# EAGLE design BioHackBoardPolulu (EAGLE 7.1.0)
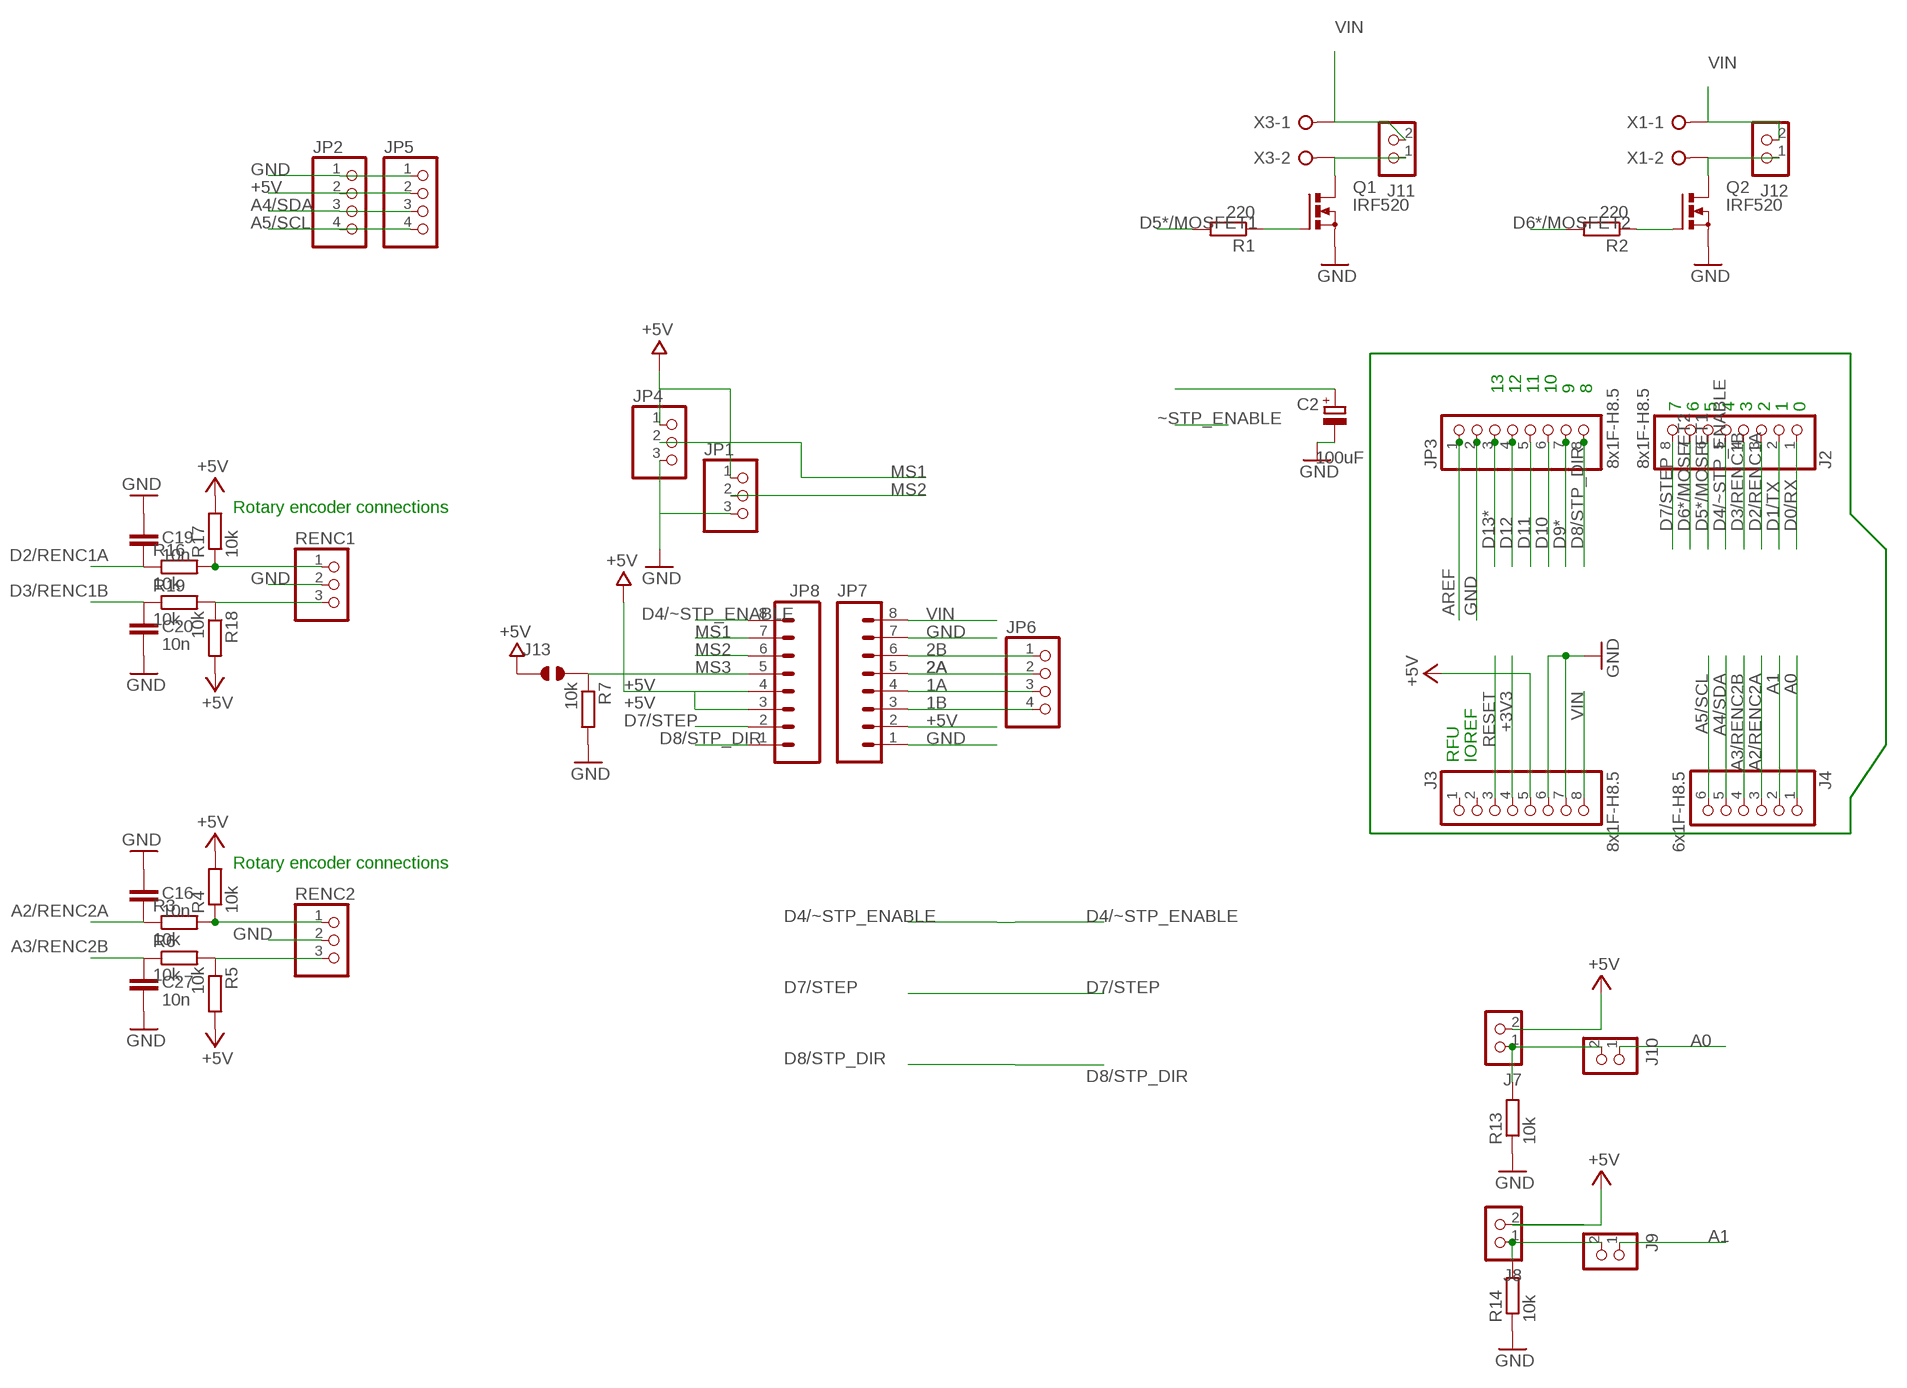
[diagram p0: schematic, sheet 1]

## Parts
C2  100uF  CPOL-EUE2.5-7  [E2,5-7]
C16  10n  C-EUC0603  [C0603-ROUND]
C19  10n  C-EUC0603  [C0603-ROUND]
C20  10n  C-EUC0603  [C0603-ROUND]
C27  10n  C-EUC0603  [C0603-ROUND]
J2  8x1F-H8.5  PINHD-1X08_2.54-S  [1X08-S]
J3  8x1F-H8.5  PINHD-1X08_2.54-S  [1X08-S]
J4  6x1F-H8.5  PINHD-1X06_2.54-S  [1X06-S]
J7  CON_HEADER_1X02-PTH  [M1X2]
J8  CON_HEADER_1X02-PTH  [M1X2]
J9  CON_HEADER_1X02-PTH  [M1X2]
J10  CON_HEADER_1X02-PTH  [M1X2]
J11  CON_HEADER_1X02-PTH  [M1X2]
J12  CON_HEADER_1X02-PTH  [M1X2]
J13  JUMPER_SOLDER_1X2  [JUMPER_SOLDER_1X2]
JP1  PINHD-1X03_2.54-S  [1X03-S]
JP2  PINHD-1X04_2.54-S  [1X04-S]
JP3  8x1F-H8.5  PINHD-1X08_2.54-S  [1X08-S]
JP4  PINHD-1X03_2.54-S  [1X03-S]
JP5  PINHD-1X04_2.54-S  [1X04-S]
JP6  PINHD-1X04_2.54-S  [1X04-S]
JP7  M081X08  [1X08]
JP8  M081X08  [1X08]
Q1  IRF520  IRF512  [TO220BV]
Q2  IRF520  IRF512  [TO220BV]
R1  220  R-EU_R0603  [R0603-ROUND]
R2  220  R-EU_R0603  [R0603-ROUND]
R3  10k  R-EU_R0603  [R0603-ROUND]
R4  10k  R-EU_R0603  [R0603-ROUND]
R5  10k  R-EU_R0603  [R0603-ROUND]
R6  10k  R-EU_R0603  [R0603-ROUND]
R7  10k  R-EU_R0603  [R0603-ROUND]
R13  10k  R-EU_R0603  [R0603]
R14  10k  R-EU_R0603  [R0603]
R16  10k  R-EU_R0603  [R0603-ROUND]
R17  10k  R-EU_R0603  [R0603-ROUND]
R18  10k  R-EU_R0603  [R0603-ROUND]
R19  10k  R-EU_R0603  [R0603-ROUND]
RENC1  PINHD-1X03_2.54-S  [1X03-S]
RENC2  PINHD-1X03_2.54-S  [1X03-S]
X1  W237-02P  [W237-132]
X3  W237-02P  [W237-132]

## Nets
1A: JP6.3 JP7.4
1B: JP6.4 JP7.3
2A: JP6.2 JP7.5
2B: JP6.1 JP7.6
+3V3: J3.4
+5V [usbvcc]: J3.5 J7.2 J8.2 J13.1 JP1.1 JP2.2 JP4.1 JP5.2 JP7.2 JP8.3 JP8.4 R4.2 R5.2 R17.2 R18.2
A0: J4.1 J10.1
A0P: J7.1 J10.2 R13.2
A1: J4.2 J9.1
A1P: J8.1 J9.2 R14.2
A2/RENC2A: C16.1 J4.3 R3.1
A3/RENC2B: C27.2 J4.4 R6.1
A4/SDA: J4.5 JP2.3 JP5.3
A5/SCL: J4.6 JP2.4 JP5.4
AREF [aref]: JP3.1
D0/RX: J2.1
D1/TX: J2.2
D2/RENC1A: C19.1 J2.3 R16.1
D3/RENC1B: C20.2 J2.4 R19.1
D4/~STP_ENABLE: J2.5 JP8.8
D5*/MOSFET1: J2.6 R1.2
D6*/MOSFET2: J2.7 R2.2
D7/STEP: J2.8 JP8.2
D8/STP_DIR: JP3.8 JP8.1
D9*: JP3.7
D10: JP3.6
D11: JP3.5
D12: JP3.4
D13*: JP3.3
GND [gnd]: C2.- C16.2 C19.2 C20.1 C27.1 J3.6 J3.7 JP1.3 JP2.1 JP3.2 JP4.3 JP5.1 JP7.1 JP7.7 Q1.S Q2.S R7.2 R13.1 R14.1 RENC1.2 RENC2.2
MS1: JP4.2 JP8.7
MS2: JP1.2 JP8.6
MS3: J13.2 JP8.5 R7.1
N$11: R16.2 R17.1 RENC1.1
N$13: R3.2 R4.1 RENC2.1
N$15: Q2.G R2.1
N$16: R18.1 R19.2 RENC1.3
N$17: Q1.G R1.1
N$18: R5.1 R6.2 RENC2.3
N$21: J11.1 Q1.D X3.2
N$23: J12.1 Q2.D X1.2
RESET: J3.3
VIN [power]: C2.+ J3.8 J11.2 J12.2 JP7.8 X1.1 X3.1
Unconnected: J3.1 J3.2

## Notes on the sheet
- 13 | 12 | 11 | 10 | 9 | 8
- 7 | 6 | 5 | 4 | 3 | 2 | 1 | 0
- Rotary encoder connections
- RFU | IOREF
- Rotary encoder connections

## Library data of the parts
C2 = rcl:CPOL-EU: POLARIZED CAPACITOR, European symbol
C16 C19 C20 C27 = SmartPrj:C-EU: CAPACITOR, European symbol
J2 J3 JP3 = pinhead-2:PINHD-1X08: PIN HEADER
J4 = pinhead-2:PINHD-1X06: PIN HEADER
J7-J12 = dp_devices:CON_HEADER_1X02
J13 = dp_devices:JUMPER_SOLDER_1X2
JP1 JP4 RENC1 RENC2 = pinhead-2:PINHD-1X03: PIN HEADER
JP2 JP5 JP6 = pinhead-2:PINHD-1X04: PIN HEADER
JP7 JP8 = SparkFun-Connectors:M08: Header 8 Standard 8-pin 0.1" header. Use with straight break away headers (SKU : PRT-00116), right angle break away headers (PRT-00553), swiss pins (PRT-00743), machine pins (PRT-00117), and female headers (PRT-00115).
Q1 Q2 = transistor-power:IRF512: N-CHANNEL MOS FET
R1-R7 R16-R19 = SmartPrj:R-EU_: RESISTOR, European symbol
R13 R14 = rcl:R-EU_: RESISTOR, European symbol
X1 X3 = con-wago-508:W237-02P: WAGO SREW CLAMP; OC_FARNELL: unknown; OC_NEWARK: unknown

## Net classes
2 gnd: width 0.254 mm, drill 0.61 mm, clearance 0.254 mm
3 usbvcc: width 0.254 mm, drill 0.61 mm, clearance 0.254 mm
4 aref: width 0.254 mm, drill 0.61 mm, clearance 0.254 mm

## Board
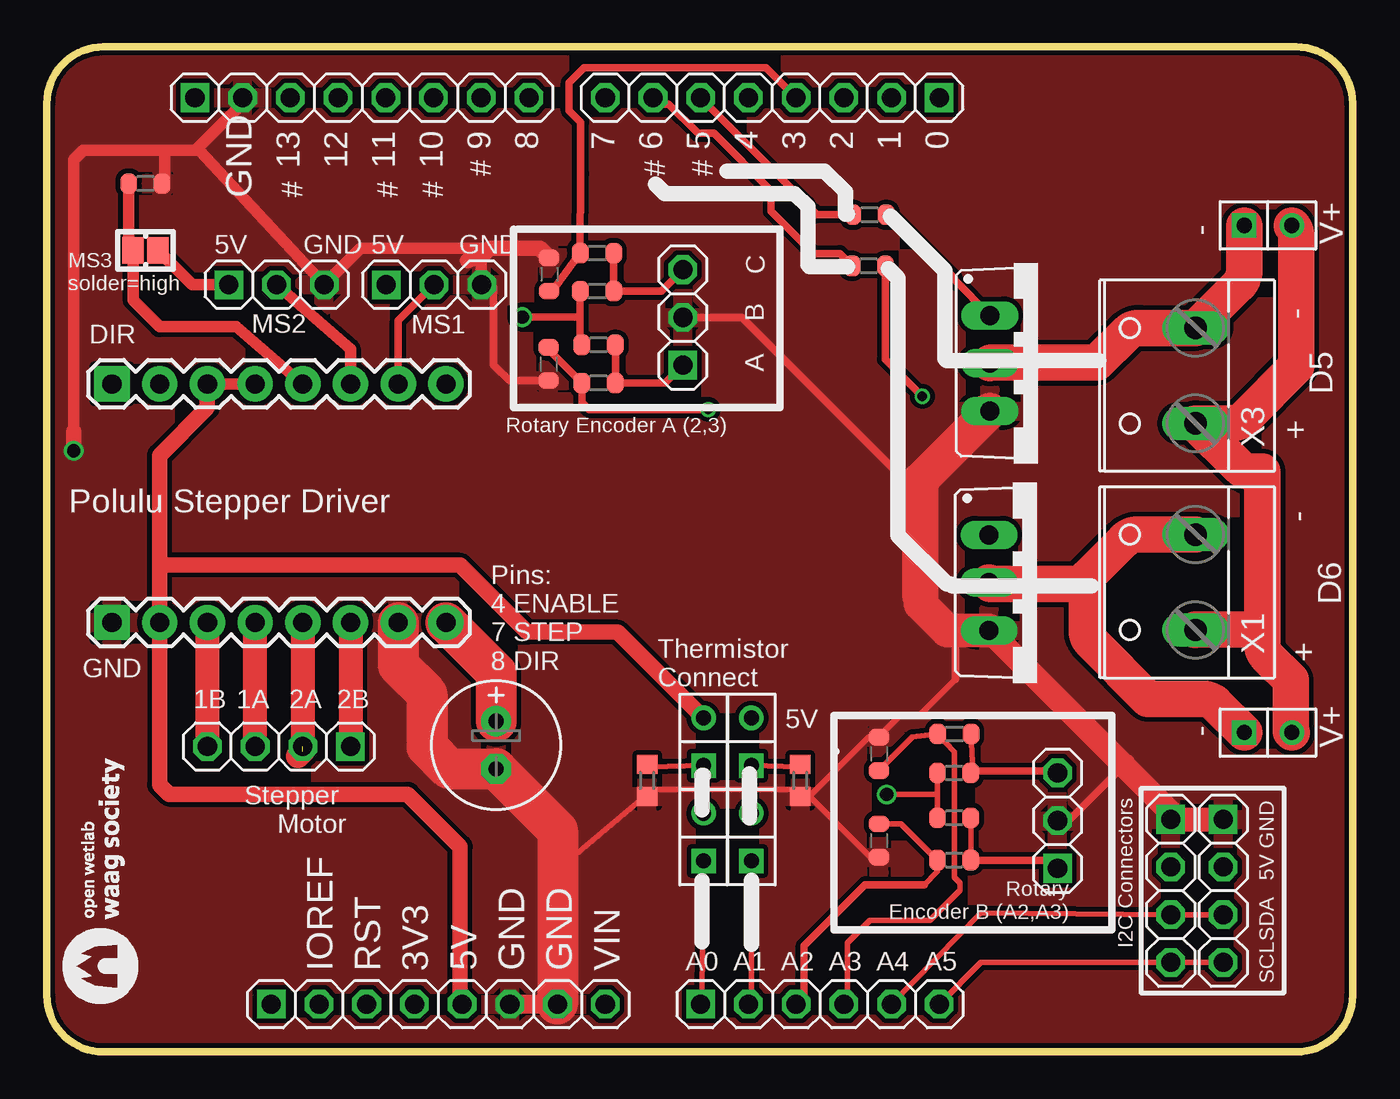
[diagram p1: board, top side]
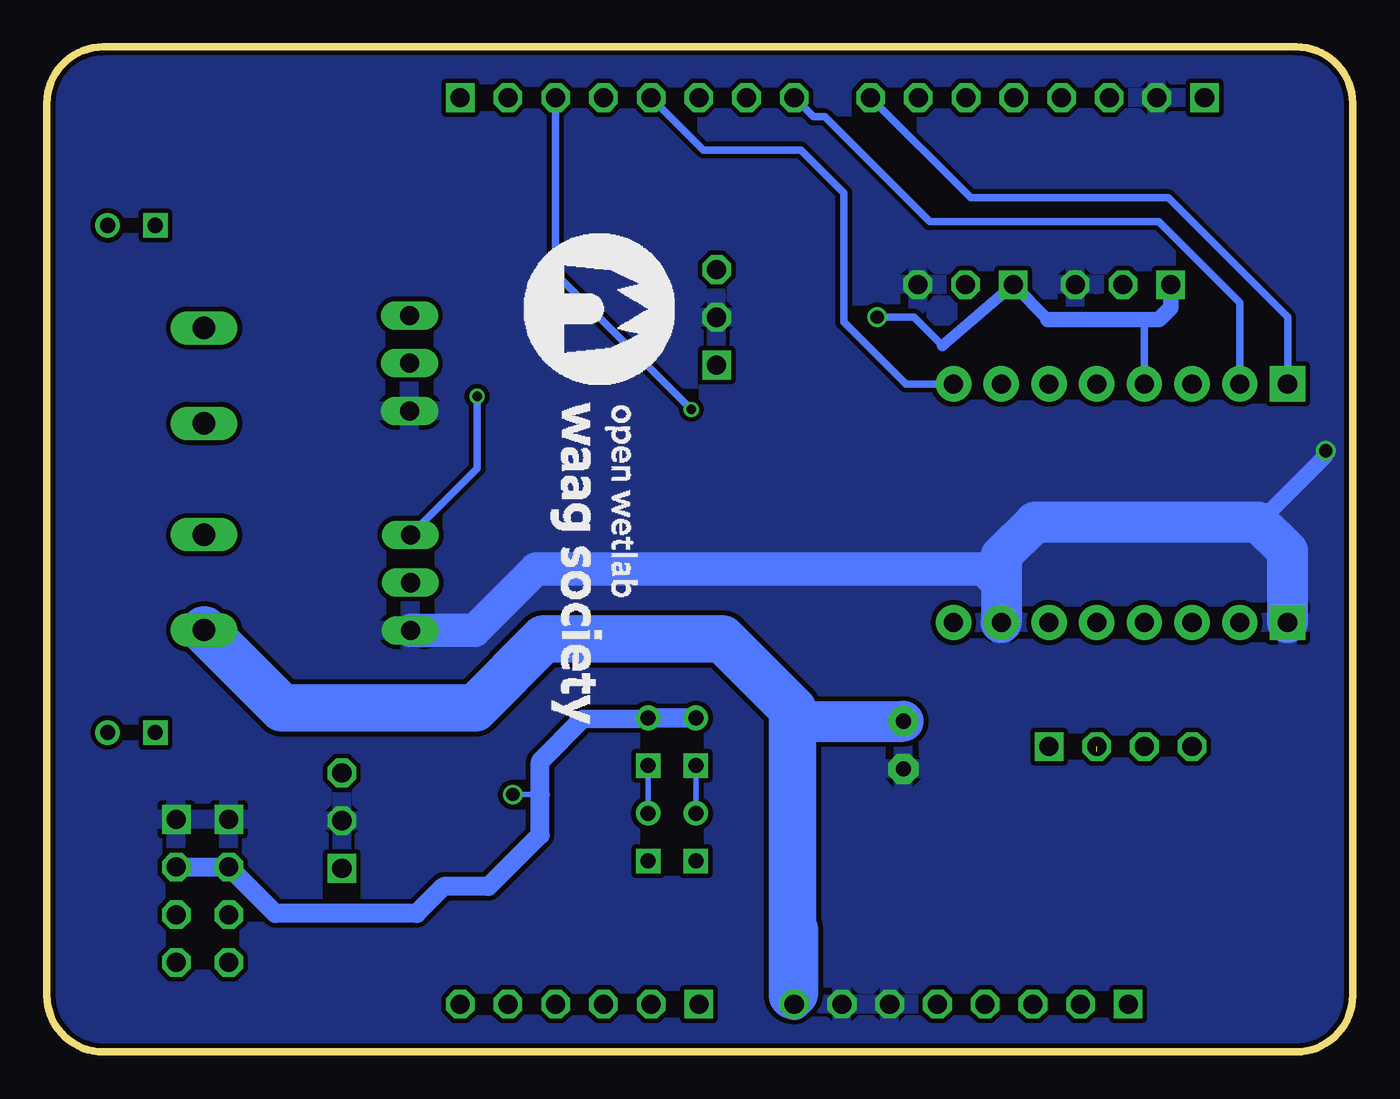
[diagram p2: board, bottom side, seen from below]

Size 69.5 x 53.5 mm. Coordinates in mm from the lower left corner, seen from the top.
Outline: 3,0 arc-90 0,3 0,50.5 arc-90 3,53.5 66.5,53.5 arc-90 69.5,50.5 69.5,3 arc-90 66.5,0 3,0
Copper layers (1*16): Top 0.035mm / dielectric 1.5mm / Bottom 0.035mm
Design rules "dirt_cheap_dirty_boards.v1": minimum track width 5mil, minimum drill 12mil, track to track 5mil, track to pad 5mil, pad to pad 5mil, via to via 5mil, smd to smd 0mil, copper to edge 10mil, drill to drill 10mil, minimum pad ring 10mil, minimum via ring 6mil, stop-mask expansion 2mil, vias tented up to drill 25mil, thermal gap 10mil
vRestrict: area 48.5,38.6 to 49.1,38.9; area 41.8,35.2 to 42.4,35.7; area 50.5,35.2 to 51.2,35.7; area 47.3,35.2 to 47.8,35.7; area 53.9,10.3 to 54.5,10.8; area 56.4,10.2 to 56.9,11

### Footprints (pad centres in the part's own frame; a part is rotated, then mirrored left to right if it is on the bottom)
E2,5-7 = drill 0.813 pad 1.6: + -1.27,0 | drill 0.813 pad 1.6 octagon: - 1.27,0
C0603-ROUND = smd 0.898 x 1.1: 1 -0.889,0; 2 0.889,0
1X08-S = drill 1.016 square: 1 -8.89,0 | drill 1.016 octagon: 2 -6.35,0; 3 -3.81,0; 4 -1.27,0; 5 1.27,0; 6 3.81,0; 7 6.35,0; 8 8.89,0
1X06-S = drill 1.016 square: 1 -6.35,0 | drill 1.016 octagon: 2 -3.81,0; 3 -1.27,0; 4 1.27,0; 5 3.81,0; 6 6.35,0
M1X2 = drill 0.8 square: 1 -1.27,0 | drill 0.8: 2 1.27,0
JUMPER_SOLDER_1X2 = smd 1.143 x 1.422: 1 -0.66,0; 2 0.66,0
1X03-S = drill 1.016 square: 1 -2.54,0 | drill 1.016 octagon: 2 0,0; 3 2.54,0
1X04-S = drill 1.016 square: 1 -3.81,0 | drill 1.016 octagon: 2 -1.27,0; 3 1.27,0; 4 3.81,0
1X08 = drill 1.016 pad 1.88 square: 1 0,0 | drill 1.016 pad 1.88: 2 2.54,0; 3 5.08,0; 4 7.62,0; 5 10.16,0; 6 12.7,0; 7 15.24,0; 8 17.78,0
TO220BV = drill 1.016 long: D 0,-2.54; G -2.54,-2.54; S 2.54,-2.54
R0603-ROUND = smd 0.898 x 1.1: 1 -0.889,0; 2 0.889,0
R0603 = smd 1 x 1.1: 1 -0.85,0; 2 0.85,0
W237-132 = drill 1.194 long: 1 -2.54,-0.635; 2 2.54,-0.635

### Placement (x,y rotation side)
C2  23.91,16.34 270 top
C16  44.29,11.25 270 top
C19  26.7,36.63 270 top
C20  26.74,41.39 270 top
C27  44.29,15.87 270 top
J2  38.61,50.8 180 top
J3  20.83,2.54 0 top
J4  41.15,2.54 0 top
J7  34.96,16.51 90 top
J8  37.5,16.51 90 top
J9  37.5,11.43 90 top
J10  34.96,11.43 90 top
J11  65,44 0 top
J12  65,17 0 top
J13  5.24,42.67 180 top
JP1  12.22,40.84 0 top
JP2  62.62,8.57 270 top
JP3  16.77,50.8 0 top
JP4  20.6,40.84 0 top
JP5  59.82,8.57 270 top
JP6  12.35,16.26 180 top
JP7  3.46,22.86 0 top
JP8  3.46,35.56 0 top
Q1  52.74,36.66 270 top
Q2  52.69,24.98 270 top
R1  43.8,44.56 180 top
R2  43.75,41.84 180 top
R3  48.29,10.21 0 top
R4  48.29,12.46 180 top
R5  48.29,14.85 180 top
R6  48.3,16.93 0 top
R7  5.24,46.23 0 top
R13  31.95,14.45 90 top
R14  40.1,14.45 90 top
R16  29.37,35.61 0 top
R17  29.37,37.64 180 top
R18  29.28,40.5 180 top
R19  29.28,42.52 0 top
RENC1  33.85,39.1 90 top
RENC2  53.8,12.31 90 top
X1  60.5,25 90 top
X3  60.5,36 90 top

### Tracks (layer width: path | path; a pad name or v marks a point on that pad's centre or on a via)
1A
  Top 1.27: JP6.3 JP7.4
1B
  Top 1.27: JP7.3 JP6.4
2A  (1 unrouted)
  Top 1.27: JP7.5 13.62,16 13.37,15.75
2B
  Top 1.27: JP7.6 JP6.1
+5V  (via drill 0.7)
  Top 0.305: R5.2 R4.2 47.4,13.7 v44.7,13.7
  Top 0.406: R18.2 28.39,39.12 | 28.39,39.12 28.39,37.73 R17.2 | v25.3,39.12 28.39,39.12
  Top 0.61: J13.1 7.73,40.84 JP1.1 | JP8.4 JP8.3
  Top 0.813: J3.5 22,2.64 22,10.92 19.21,13.72 6.51,13.72 6,14.22 JP7.2 6,25.91 | 6,25.91 6,31.75 8.54,34.29 JP8.3 | J7.2 30.38,22.35 25.56,22.35 22,25.91 6,25.91
  Bottom 0.305: v44.7,13.7 43.25,13.7
  Bottom 0.406: 21.82,37.59 23.34,39.12 v25.3,39.12 | 10.32,38.99 10.95,38.99 11.08,38.86 JP8.4
  Bottom 0.61: 16.21,38.99 JP4.1 21.82,37.59
  Bottom 0.813: JP1.1 9.68,39.63 10.32,38.99 16.21,38.99
  Bottom 1.016: JP2.2 JP5.2 57.35,7.37 49.81,7.37 48.38,8.8 46,8.8 43.25,11.55 43.25,13.7 43.25,15.45 40.98,17.72 J7.2 J8.2
A0
  Top 0.305: J4.1 34.88,3.09 J10.1
A0P
  Top 0.305: R13.2 32.07,15.18 J7.1
  Bottom 0.305: J10.2 J7.1
A1
  Top 0.305: J4.2 37.5,2.7 J9.1
A1P
  Top 0.305: R14.2 40.03,15.18 J8.1
  Bottom 0.305: J9.2 J8.1
A2/RENC2A
  Top 0.305: J4.3 40.3,2.96 | C16.1 45.47,12.14 R3.1 47.4,9.6 46.7,8.9
  Top 0.406: 40.3,2.96 40.3,5.65 43.55,8.9 46.7,8.9
A3/RENC2B
  Top 0.305: J4.4 42.6,2.72 42.6,5.8 43.8,7 47,7 48.6,8.6 48.6,9 48.3,9.3 48.3,15.96 R6.1 46.07,16.76 C27.2
A4/SDA
  Top 0.305: J4.5 49.72,7.4 JP5.3 JP2.3
  Top 0.406: J4.5 44.8,2.7
A5/SCL
  Top 0.305: J4.6 49.72,4.76 JP5.4 JP2.4
  Top 0.406: J4.6 47.34,2.7
D2/RENC1A  (via drill 0.5)
  Top 0.406: C19.1 26.7,37.39 R16.1 28.48,34.58 28.86,34.2 v35.2,34.2
  Bottom 0.406: J2.3 42.42,41.42 v35.2,34.2
D3/RENC1B
  Top 0.406: C20.2 26.99,40.39 26.99,40.63 R19.1 28.41,46.75 28.41,49.49 27.8,50.1 27.8,51.6 28.6,52.4 38.28,52.4 J2.4
D4/~STP_ENABLE
  Bottom 0.406: JP8.8 23.78,35.56 27.08,38.86 27.08,45.72 29.37,48.01 34.55,48.01 J2.5
D5*/MOSFET1
  Top 0.406: J2.6 40.46,45.14 40.46,45.09 40.99,44.56 R1.2
D6*/MOSFET2
  Top 0.406: J2.7 32.61,50.45 33.1,50.45 34.65,48.9 35.5,48.9 38.55,45.85 38.55,44.75 40.8,42.5 42.2,42.5 R2.2
D7/STEP
  Bottom 0.406: JP8.2 6,39.88 10.32,44.2 22.51,44.2 28.1,49.78 28.7,49.78 J2.8
D8/STP_DIR
  Bottom 0.406: JP8.1 3.46,39.12 9.81,45.47 20.32,45.47 JP3.8
GND  (via drill 0.7)
  Top 0.305: 27.18,9.7 31.9,13.65 R13.1 32.32,13.97 39.91,13.97 R14.1 40.6,13.6 | C16.2 43.84,10.36 40.6,13.6 | 48.36,19.83 46.43,17.9 45.4,17.9 44.29,16.79 C27.1 43.76,16.76 40.6,13.6
  Top 0.406: C20.1 26.99,42.43 | Q1.S 49.62,34.7 | 48.36,19.83 48.36,22.44 | C19.2 24.62,35.74 23.78,36.58 23.78,40.71 JP4.3 | RENC1.2 37,39.1 45.62,30.48 46.25,30.48 46.5,30.23 | RENC2.2 54.38,12.31 57.33,15.26
  Top 0.61: 27.45,9.68 27.18,9.41 | 8.1,48.2 10.42,50.52 JP3.2 | 8.1,48.2 8.1,48.02 JP1.3 16.7,42.78 23.55,42.78 | JP4.3 23.1,41.39 23.1,42.33 | 8.1,48.2 7.91,48.01 6.25,48.01 | 6.25,48.01 1.94,48.01 1.43,47.5 1.43,33.02 | R7.2 6.25,46.35 6.25,48.01 | C19.2 26.57,35.61
  Top 0.813: 22.38,42.12 23.1,42.33 23.55,42.78 26.23,42.78 C20.1 | v1.43,32 1.43,33.02
  Top 1.016: 27.18,9.7 27.18,9.41 J3.7 J3.6
  Top 1.27: Q2.S 57.33,15.26 59.82,12.76 JP5.1 JP2.1
  Top 1.778: 46.5,24.3 46.5,23.85 47.91,22.44 Q2.S
  Top 1.93: Q1.S 46.5,30.42 46.5,30.23 46.5,24.3
  Top 2.184: JP7.7 18.7,20.57 20.22,19.05 20.22,16.26 21.41,15.06 C2.- 27.18,11.8 J3.7
  Bottom 0.813: 4.98,28.19 1.43,31.75 v1.43,32
  Bottom 1.778: Q2.S 46.74,22.44 43.47,25.72 19.65,25.72 18.7,24.77
  Bottom 2.184: JP7.1 3.46,26.67 4.98,28.19 16.92,28.19 18.7,26.42 18.7,24.77 JP7.7
  pour Bottom (isolate 0.254): -0.32,54 70.77,54.11 70.77,-0.69 -1.22,-1.3 -1.22,51.4
  pour Top (isolate 0.254): -0.97,54.99 70.32,55.4 70.32,0.1 -1.17,-0.81 -1.17,52.29
MS1
  Top 0.406: JP8.7 18.7,38.94 JP4.2
MS2
  Top 0.61: JP1.2 16.16,37.41 JP8.6
MS3
  Top 0.61: JP8.5 10.06,38.61 6,38.61 4.58,40.03 J13.2 4.35,42.9 R7.1
N$11
  Top 0.406: R17.1 R16.2 32.89,35.61 RENC1.1
N$13
  Top 0.305: R3.2 R4.1
  Top 0.406: R3.2 53.36,10.21 RENC2.1
N$15  (via drill 0.5)
  Top 0.406: R2.1 44.63,36.87 v46.6,34.9
  Bottom 0.406: v46.6,34.9 46.6,31.07 Q2.G
N$16
  Top 0.406: R19.2 R18.1 32.7,40.5 RENC1.3
N$17
  Top 0.406: R1.1 44.94,44.56 48.3,41.2 48.3,41.1 Q1.G
N$18
  Top 0.305: R5.1 49.28,14.95 R6.2
  Top 0.406: 49.28,14.95 53.7,14.95 RENC2.3
N$21
  Top 1.93: Q1.D 50.24,36.7 55.9,36.7 57.45,38.25 arc-45 58.15,38.54 X3.2 63.44,40.84 arc45 63.73,41.55 J11.1
N$23
  Top 1.93: Q2.D 50.23,24.9 55,24.9 55.35,25.25 | 55.35,25.25 57.35,27.25 arc-45 58.05,27.54 X1.2 | J12.1 62.22,18.51 arc45 61.52,18.8 58.6,18.8 55.64,21.76 arc-45 55.35,22.46 55.35,25.25
VIN
  Top 1.93: 64.7,22.5 64.7,30.89 64.11,30.89 arc-45 63.41,31.19 X3.1 63.05,33.46 arc45 63.75,33.75 66.5,36.5 66.5,43.45 arc45 J11.2 | 64.7,22.5 64.7,21.71 arc45 64.99,21.01 66.2,19.8 66.2,17.17 arc45 J12.2 | X1.1 arc-45 61.23,22.5 64.7,22.5
  Top 2.184: JP7.8 23.91,20.19 C2.+
  Bottom 1.676: J3.8 29.72,6.5
  Bottom 2.184: 29.82,18.26 29.16,17.61 C2.+
  Bottom 2.54: 29.72,6.5 29.72,3.11 29.82,3.01 29.82,18.26 33.53,21.97 43.06,21.97 46.72,18.31 56.98,18.31 X1.1

### Text on the board
tPlace: 13 | 12 | 11 | 10 | 9 | 8 | 7 | 6 | 5 | 4 | 3 | 2 | 1 | 0 | - | V+ | 5V | GND | 5V | GND | MS3 / solder=high | C | DIR | B | - | MS2 | MS1 | A | D5 | Rotary Encoder A (2,3) | + | Polulu Stepper Driver | - | D6 | GND | + | Pins: / 4 ENABLE / 7 STEP / 8 DIR | 1B | 1A | 2A | 2B | Thermistor / Connect | 5V | - | V+ | Stepper / Motor | I2C Connectors | GND | 5V | Rotary / Encoder B (A2,A3) | SDA | SCL
tNames: # | # | # | GND | # | # | # | IOREF | RST | 3V3 | 5V | GND | GND | VIN | A0 | A1 | A2 | A3 | A4 | A5